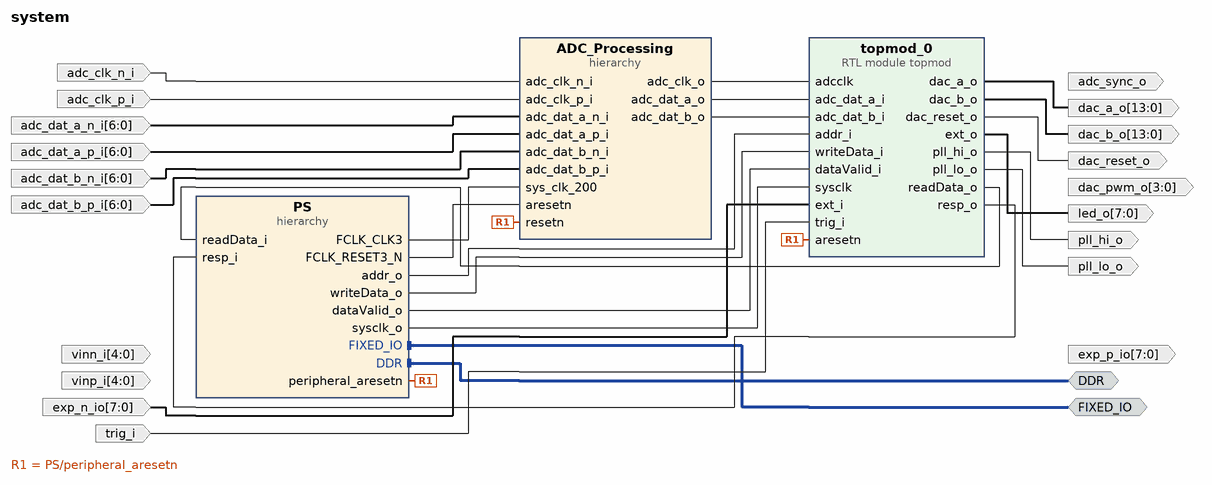
[diagram p0: block diagram of the top level]
# Vivado block design system, xc7z020clg400-3, Vivado 2020.2
create_bd_design system

create_bd_intf_port -mode Master -vlnv xilinx.com:interface:ddrx_rtl:1.0 DDR
create_bd_intf_port -mode Master -vlnv xilinx.com:display_processing_system7:fixedio_rtl:1.0 FIXED_IO
create_bd_port -dir O -from 3 -to 0 dac_pwm_o
create_bd_port -dir O -from 7 -to 0 led_o
create_bd_port -dir I -from 4 -to 0 vinp_i
create_bd_port -dir I -from 4 -to 0 vinn_i
create_bd_port -dir I -from 7 -to 0 exp_n_io
create_bd_port -dir O -from 7 -to 0 exp_p_io
create_bd_port -dir O -from 13 -to 0 dac_a_o
create_bd_port -dir O -from 13 -to 0 dac_b_o
create_bd_port -dir O dac_reset_o
create_bd_port -dir O pll_hi_o
create_bd_port -dir O pll_lo_o
create_bd_port -dir I -from 6 -to 0 -type data adc_dat_a_p_i
create_bd_port -dir I -from 6 -to 0 -type data adc_dat_a_n_i
create_bd_port -dir I -from 6 -to 0 -type data adc_dat_b_p_i
create_bd_port -dir I -from 6 -to 0 -type data adc_dat_b_n_i
create_bd_port -dir I -type clk adc_clk_p_i
set_property -dict {CONFIG.FREQ_HZ 250000000} [get_bd_ports adc_clk_p_i]
create_bd_port -dir I -type clk adc_clk_n_i
set_property -dict {CONFIG.FREQ_HZ 250000000} [get_bd_ports adc_clk_n_i]
create_bd_port -dir O adc_sync_o
create_bd_port -dir I trig_i

create_bd_cell -type hier PS
create_bd_cell -type hier ADC_Processing
create_bd_cell -type module -reference topmod topmod_0

# ---- hierarchy /PS ----
current_bd_instance /PS
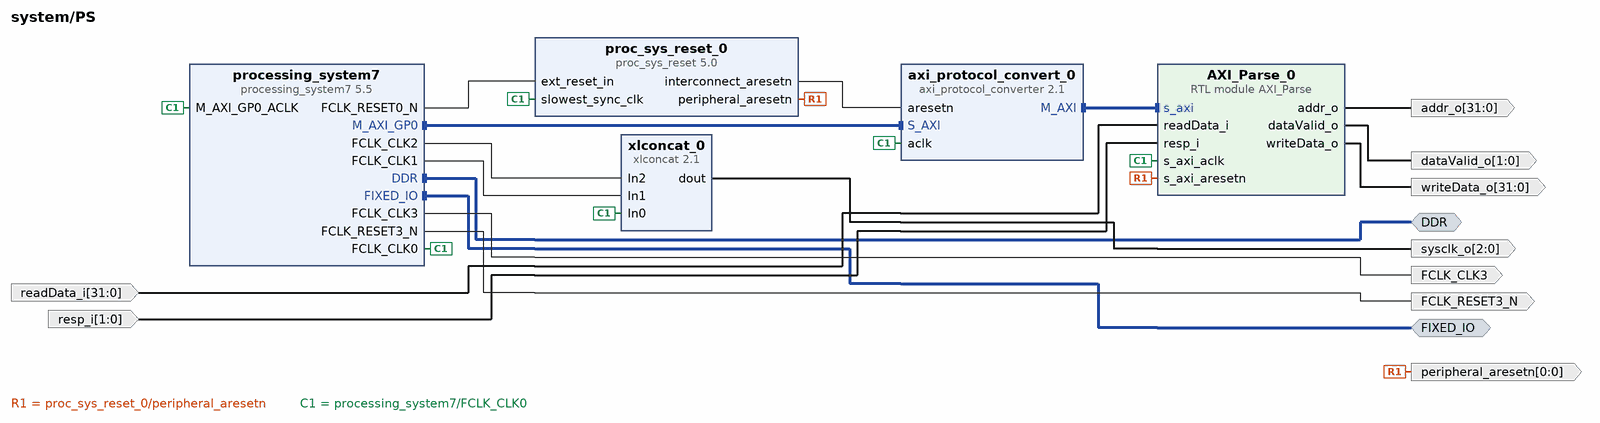
[diagram p1: block diagram inside /PS]
create_bd_intf_pin -mode Master -vlnv xilinx.com:interface:ddrx_rtl:1.0 DDR
create_bd_intf_pin -mode Master -vlnv xilinx.com:display_processing_system7:fixedio_rtl:1.0 FIXED_IO
create_bd_pin -dir O -from 0 -to 0 -type rst peripheral_aresetn
create_bd_pin -dir O -from 31 -to 0 addr_o
create_bd_pin -dir O -from 31 -to 0 writeData_o
create_bd_pin -dir O -from 1 -to 0 dataValid_o
create_bd_pin -dir I -from 31 -to 0 readData_i
create_bd_pin -dir I -from 1 -to 0 resp_i
create_bd_pin -dir O -from 2 -to 0 sysclk_o
create_bd_pin -dir O -type clk FCLK_CLK3
create_bd_pin -dir O -type rst FCLK_RESET3_N

create_bd_cell -type ip -vlnv xilinx.com:ip:proc_sys_reset:5.0 proc_sys_reset_0
create_bd_cell -type ip -vlnv xilinx.com:ip:processing_system7:5.5 processing_system7
set_property -dict [list \
  CONFIG.PCW_APU_PERIPHERAL_FREQMHZ 666.666666 \
  CONFIG.PCW_CPU_CPU_6X4X_MAX_RANGE 867 \
  CONFIG.PCW_ENET0_ENET0_IO {MIO 16 .. 27} \
  CONFIG.PCW_ENET0_GRP_MDIO_ENABLE 1 \
  CONFIG.PCW_ENET0_GRP_MDIO_IO {MIO 52 .. 53} \
  CONFIG.PCW_ENET0_PERIPHERAL_ENABLE 1 \
  CONFIG.PCW_ENET0_RESET_ENABLE 0 \
  CONFIG.PCW_ENET_RESET_ENABLE 1 \
  CONFIG.PCW_ENET_RESET_SELECT {Share reset pin} \
  CONFIG.PCW_EN_CLK1_PORT 1 \
  CONFIG.PCW_EN_CLK2_PORT 1 \
  CONFIG.PCW_EN_CLK3_PORT 1 \
  CONFIG.PCW_EN_RST1_PORT 1 \
  CONFIG.PCW_EN_RST2_PORT 1 \
  CONFIG.PCW_EN_RST3_PORT 1 \
  CONFIG.PCW_FCLK_CLK1_BUF TRUE \
  CONFIG.PCW_FCLK_CLK2_BUF TRUE \
  CONFIG.PCW_FCLK_CLK3_BUF TRUE \
  CONFIG.PCW_FPGA0_PERIPHERAL_FREQMHZ 125 \
  CONFIG.PCW_FPGA1_PERIPHERAL_FREQMHZ 250 \
  CONFIG.PCW_FPGA3_PERIPHERAL_FREQMHZ 200 \
  CONFIG.PCW_FPGA_FCLK1_ENABLE 1 \
  CONFIG.PCW_FPGA_FCLK2_ENABLE 1 \
  CONFIG.PCW_FPGA_FCLK3_ENABLE 1 \
  CONFIG.PCW_GPIO_EMIO_GPIO_ENABLE 1 \
  CONFIG.PCW_GPIO_EMIO_GPIO_IO 24 \
  CONFIG.PCW_GPIO_EMIO_GPIO_WIDTH 24 \
  CONFIG.PCW_GPIO_MIO_GPIO_ENABLE 1 \
  CONFIG.PCW_GPIO_MIO_GPIO_IO MIO \
  CONFIG.PCW_I2C0_GRP_INT_ENABLE 0 \
  CONFIG.PCW_I2C0_I2C0_IO {MIO 50 .. 51} \
  CONFIG.PCW_I2C0_PERIPHERAL_ENABLE 1 \
  CONFIG.PCW_I2C_PERIPHERAL_FREQMHZ 111.111115 \
  CONFIG.PCW_I2C_RESET_ENABLE 1 \
  CONFIG.PCW_I2C_RESET_SELECT {Share reset pin} \
  CONFIG.PCW_PERIPHERAL_BOARD_PRESET None \
  CONFIG.PCW_PRESET_BANK1_VOLTAGE {LVCMOS 2.5V} \
  CONFIG.PCW_QSPI_PERIPHERAL_ENABLE 0 \
  CONFIG.PCW_SD0_GRP_CD_ENABLE 1 \
  CONFIG.PCW_SD0_GRP_CD_IO {MIO 46} \
  CONFIG.PCW_SD0_GRP_WP_ENABLE 1 \
  CONFIG.PCW_SD0_GRP_WP_IO {MIO 47} \
  CONFIG.PCW_SD0_PERIPHERAL_ENABLE 1 \
  CONFIG.PCW_SD0_SD0_IO {MIO 40 .. 45} \
  CONFIG.PCW_SDIO_PERIPHERAL_FREQMHZ 100 \
  CONFIG.PCW_SPI0_PERIPHERAL_ENABLE 1 \
  CONFIG.PCW_SPI0_SPI0_IO EMIO \
  CONFIG.PCW_SPI1_PERIPHERAL_ENABLE 1 \
  CONFIG.PCW_SPI1_SPI1_IO {MIO 10 .. 15} \
  CONFIG.PCW_SPI_PERIPHERAL_FREQMHZ 200 \
  CONFIG.PCW_TTC0_PERIPHERAL_ENABLE 1 \
  CONFIG.PCW_TTC0_TTC0_IO EMIO \
  CONFIG.PCW_UART0_PERIPHERAL_ENABLE 1 \
  CONFIG.PCW_UART0_UART0_IO {MIO 14 .. 15} \
  CONFIG.PCW_UART1_PERIPHERAL_ENABLE 1 \
  CONFIG.PCW_UART1_UART1_IO {MIO 8 .. 9} \
  CONFIG.PCW_UART_PERIPHERAL_FREQMHZ 100 \
  CONFIG.PCW_UIPARAM_DDR_FREQ_MHZ 533.333333 \
  CONFIG.PCW_UIPARAM_DDR_PARTNO {MT41J256M16 RE-125} \
  CONFIG.PCW_USB0_PERIPHERAL_ENABLE 1 \
  CONFIG.PCW_USB0_RESET_ENABLE 1 \
  CONFIG.PCW_USB0_RESET_IO {MIO 48} \
  CONFIG.PCW_USB0_USB0_IO {MIO 28 .. 39} \
  CONFIG.PCW_USB_RESET_ENABLE 1 \
  CONFIG.PCW_USB_RESET_SELECT {Share reset pin} \
  CONFIG.preset None \
] [get_bd_cells processing_system7]
# 501 more settings of processing_system7 are not shown: defaults, MIO pin electricals, DDR timing, and values the tool derives
create_bd_cell -type module -reference AXI_Parse AXI_Parse_0
create_bd_cell -type ip -vlnv xilinx.com:ip:xlconcat:2.1 xlconcat_0
set_property -dict {CONFIG.NUM_PORTS 3} [get_bd_cells xlconcat_0]
create_bd_cell -type ip -vlnv xilinx.com:ip:axi_protocol_converter:2.1 axi_protocol_convert_0

# ---- hierarchy /ADC_Processing ----
current_bd_instance /ADC_Processing
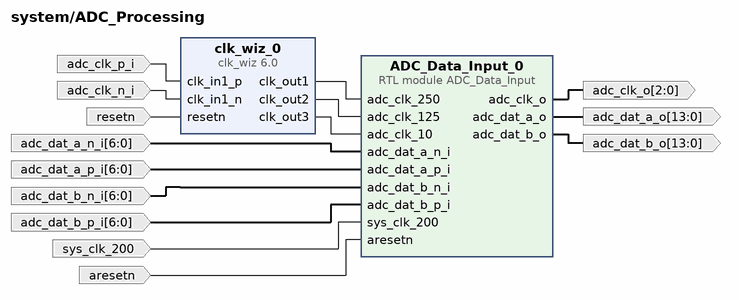
[diagram p2: block diagram inside /ADC_Processing]
create_bd_pin -dir I -type clk adc_clk_p_i
create_bd_pin -dir I -type clk adc_clk_n_i
create_bd_pin -dir I -type rst resetn
create_bd_pin -dir I -from 6 -to 0 -type data adc_dat_a_n_i
create_bd_pin -dir I -from 6 -to 0 -type data adc_dat_a_p_i
create_bd_pin -dir I -from 6 -to 0 -type data adc_dat_b_n_i
create_bd_pin -dir I -from 6 -to 0 -type data adc_dat_b_p_i
create_bd_pin -dir O -from 2 -to 0 adc_clk_o
create_bd_pin -dir O -from 13 -to 0 adc_dat_a_o
create_bd_pin -dir O -from 13 -to 0 adc_dat_b_o
create_bd_pin -dir I -type clk sys_clk_200
create_bd_pin -dir I -type rst aresetn

create_bd_cell -type ip -vlnv xilinx.com:ip:clk_wiz:6.0 clk_wiz_0
set_property -dict [list \
  CONFIG.CLKIN1_JITTER_PS 40.0 \
  CONFIG.CLKOUT1_JITTER 89.528 \
  CONFIG.CLKOUT1_PHASE_ERROR 85.928 \
  CONFIG.CLKOUT1_REQUESTED_OUT_FREQ 250 \
  CONFIG.CLKOUT2_JITTER 102.531 \
  CONFIG.CLKOUT2_PHASE_ERROR 85.928 \
  CONFIG.CLKOUT2_REQUESTED_OUT_FREQ 125 \
  CONFIG.CLKOUT2_USED true \
  CONFIG.CLKOUT3_JITTER 169.738 \
  CONFIG.CLKOUT3_PHASE_ERROR 85.928 \
  CONFIG.CLKOUT3_REQUESTED_OUT_FREQ 10 \
  CONFIG.CLKOUT3_USED true \
  CONFIG.MMCM_CLKFBOUT_MULT_F 4.000 \
  CONFIG.MMCM_CLKIN1_PERIOD 4.000 \
  CONFIG.MMCM_CLKIN2_PERIOD 10.0 \
  CONFIG.MMCM_CLKOUT0_DIVIDE_F 4.000 \
  CONFIG.MMCM_CLKOUT1_DIVIDE 8 \
  CONFIG.MMCM_CLKOUT2_DIVIDE 100 \
  CONFIG.NUM_OUT_CLKS 3 \
  CONFIG.PRIM_IN_FREQ 250 \
  CONFIG.PRIM_SOURCE Differential_clock_capable_pin \
  CONFIG.RESET_PORT resetn \
  CONFIG.RESET_TYPE ACTIVE_LOW \
  CONFIG.USE_LOCKED false \
] [get_bd_cells clk_wiz_0]
create_bd_cell -type module -reference ADC_Data_Input ADC_Data_Input_0

# ---- connections ----

current_bd_instance /PS
connect_bd_intf_net [get_bd_intf_pins DDR] [get_bd_intf_pins processing_system7/DDR]
connect_bd_intf_net [get_bd_intf_pins FIXED_IO] [get_bd_intf_pins processing_system7/FIXED_IO]
connect_bd_intf_net [get_bd_intf_pins axi_protocol_convert_0/M_AXI] [get_bd_intf_pins AXI_Parse_0/s_axi]
connect_bd_intf_net [get_bd_intf_pins axi_protocol_convert_0/S_AXI] [get_bd_intf_pins processing_system7/M_AXI_GP0]
connect_bd_net [get_bd_pins processing_system7/FCLK_RESET0_N] [get_bd_pins proc_sys_reset_0/ext_reset_in]
connect_bd_net [get_bd_pins proc_sys_reset_0/peripheral_aresetn] [get_bd_pins peripheral_aresetn] [get_bd_pins AXI_Parse_0/s_axi_aresetn]
connect_bd_net [get_bd_pins AXI_Parse_0/addr_o] [get_bd_pins addr_o]
connect_bd_net [get_bd_pins AXI_Parse_0/writeData_o] [get_bd_pins writeData_o]
connect_bd_net [get_bd_pins AXI_Parse_0/dataValid_o] [get_bd_pins dataValid_o]
connect_bd_net [get_bd_pins readData_i] [get_bd_pins AXI_Parse_0/readData_i]
connect_bd_net [get_bd_pins resp_i] [get_bd_pins AXI_Parse_0/resp_i]
connect_bd_net [get_bd_pins processing_system7/FCLK_CLK2] [get_bd_pins xlconcat_0/In2]
connect_bd_net [get_bd_pins processing_system7/FCLK_CLK0] \
  [get_bd_pins proc_sys_reset_0/slowest_sync_clk] [get_bd_pins processing_system7/M_AXI_GP0_ACLK] \
  [get_bd_pins AXI_Parse_0/s_axi_aclk] [get_bd_pins xlconcat_0/In0] [get_bd_pins axi_protocol_convert_0/aclk]
connect_bd_net [get_bd_pins xlconcat_0/dout] [get_bd_pins sysclk_o]
connect_bd_net [get_bd_pins processing_system7/FCLK_CLK1] [get_bd_pins xlconcat_0/In1]
connect_bd_net [get_bd_pins processing_system7/FCLK_CLK3] [get_bd_pins FCLK_CLK3]
connect_bd_net [get_bd_pins processing_system7/FCLK_RESET3_N] [get_bd_pins FCLK_RESET3_N]
connect_bd_net [get_bd_pins proc_sys_reset_0/interconnect_aresetn] [get_bd_pins axi_protocol_convert_0/aresetn]

current_bd_instance /ADC_Processing
connect_bd_net [get_bd_pins clk_wiz_0/clk_out1] [get_bd_pins ADC_Data_Input_0/adc_clk_250]
connect_bd_net [get_bd_pins clk_wiz_0/clk_out2] [get_bd_pins ADC_Data_Input_0/adc_clk_125]
connect_bd_net [get_bd_pins clk_wiz_0/clk_out3] [get_bd_pins ADC_Data_Input_0/adc_clk_10]
connect_bd_net [get_bd_pins adc_clk_p_i] [get_bd_pins clk_wiz_0/clk_in1_p]
connect_bd_net [get_bd_pins adc_clk_n_i] [get_bd_pins clk_wiz_0/clk_in1_n]
connect_bd_net -net PS_peripheral_aresetn [get_bd_pins resetn] [get_bd_pins clk_wiz_0/resetn]
connect_bd_net [get_bd_pins adc_dat_a_n_i] [get_bd_pins ADC_Data_Input_0/adc_dat_a_n_i]
connect_bd_net [get_bd_pins adc_dat_a_p_i] [get_bd_pins ADC_Data_Input_0/adc_dat_a_p_i]
connect_bd_net [get_bd_pins adc_dat_b_n_i] [get_bd_pins ADC_Data_Input_0/adc_dat_b_n_i]
connect_bd_net [get_bd_pins adc_dat_b_p_i] [get_bd_pins ADC_Data_Input_0/adc_dat_b_p_i]
connect_bd_net [get_bd_pins ADC_Data_Input_0/adc_clk_o] [get_bd_pins adc_clk_o]
connect_bd_net [get_bd_pins ADC_Data_Input_0/adc_dat_a_o] [get_bd_pins adc_dat_a_o]
connect_bd_net [get_bd_pins ADC_Data_Input_0/adc_dat_b_o] [get_bd_pins adc_dat_b_o]
connect_bd_net -net sys_clk_200_1 [get_bd_pins sys_clk_200] [get_bd_pins ADC_Data_Input_0/sys_clk_200]
connect_bd_net [get_bd_pins aresetn] [get_bd_pins ADC_Data_Input_0/aresetn]

current_bd_instance /
connect_bd_intf_net [get_bd_intf_ports FIXED_IO] [get_bd_intf_pins PS/FIXED_IO]
connect_bd_intf_net [get_bd_intf_ports DDR] [get_bd_intf_pins PS/DDR]
connect_bd_net [get_bd_pins topmod_0/ext_o] [get_bd_ports led_o]
connect_bd_net [get_bd_pins topmod_0/dac_a_o] [get_bd_ports dac_a_o]
connect_bd_net [get_bd_pins topmod_0/dac_b_o] [get_bd_ports dac_b_o]
connect_bd_net [get_bd_pins topmod_0/dac_reset_o] [get_bd_ports dac_reset_o]
connect_bd_net [get_bd_pins topmod_0/pll_hi_o] [get_bd_ports pll_hi_o]
connect_bd_net [get_bd_pins topmod_0/pll_lo_o] [get_bd_ports pll_lo_o]
connect_bd_net [get_bd_pins PS/peripheral_aresetn] [get_bd_pins ADC_Processing/resetn] [get_bd_pins topmod_0/aresetn]
connect_bd_net [get_bd_pins PS/addr_o] [get_bd_pins topmod_0/addr_i]
connect_bd_net [get_bd_pins PS/writeData_o] [get_bd_pins topmod_0/writeData_i]
connect_bd_net [get_bd_pins PS/dataValid_o] [get_bd_pins topmod_0/dataValid_i]
connect_bd_net [get_bd_pins topmod_0/readData_o] [get_bd_pins PS/readData_i]
connect_bd_net [get_bd_pins topmod_0/resp_o] [get_bd_pins PS/resp_i]
connect_bd_net [get_bd_ports adc_clk_n_i] [get_bd_pins ADC_Processing/adc_clk_n_i]
connect_bd_net [get_bd_ports adc_clk_p_i] [get_bd_pins ADC_Processing/adc_clk_p_i]
connect_bd_net [get_bd_ports adc_dat_a_n_i] [get_bd_pins ADC_Processing/adc_dat_a_n_i]
connect_bd_net [get_bd_ports adc_dat_a_p_i] [get_bd_pins ADC_Processing/adc_dat_a_p_i]
connect_bd_net [get_bd_ports adc_dat_b_n_i] [get_bd_pins ADC_Processing/adc_dat_b_n_i]
connect_bd_net [get_bd_ports adc_dat_b_p_i] [get_bd_pins ADC_Processing/adc_dat_b_p_i]
connect_bd_net -net PS_dout [get_bd_pins PS/sysclk_o] [get_bd_pins topmod_0/sysclk]
connect_bd_net -net ADC_Data_Input_0_adc_clk_o [get_bd_pins ADC_Processing/adc_clk_o] [get_bd_pins topmod_0/adcclk]
connect_bd_net -net ADC_Data_Input_0_adc_dat_a_o [get_bd_pins ADC_Processing/adc_dat_a_o] [get_bd_pins topmod_0/adc_dat_a_i]
connect_bd_net -net ADC_Data_Input_0_adc_dat_b_o [get_bd_pins ADC_Processing/adc_dat_b_o] [get_bd_pins topmod_0/adc_dat_b_i]
connect_bd_net [get_bd_ports exp_n_io] [get_bd_pins topmod_0/ext_i]
connect_bd_net [get_bd_pins PS/FCLK_CLK3] [get_bd_pins ADC_Processing/sys_clk_200]
# net topmod_0_adc_sync_o has one end: adc_sync_o
connect_bd_net -net aresetn_1 [get_bd_pins PS/FCLK_RESET3_N] [get_bd_pins ADC_Processing/aresetn]
connect_bd_net [get_bd_ports trig_i] [get_bd_pins topmod_0/trig_i]

# ---- address map ----
assign_bd_address -offset 0x40000000 -range 1G -target_address_space [get_bd_addr_spaces PS/processing_system7/Data] [get_bd_addr_segs PS/AXI_Parse_0/s_axi/reg0]

validate_bd_design
save_bd_design
